# Altium schematic sheet Sheet_1_2021-05-04.schdoc
size 183 x 188 mm
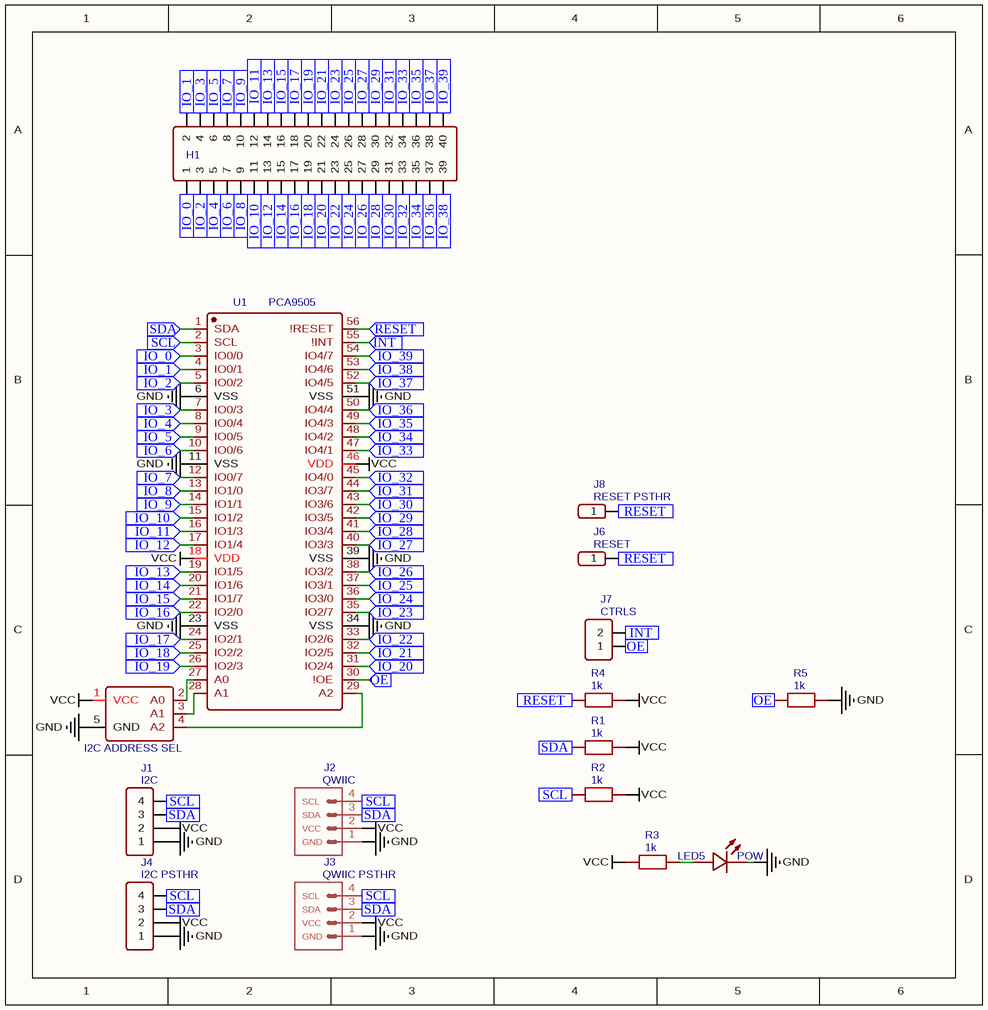
[diagram p0: Sheet_1_2021-05-04.schdoc]

## Parts
H1  HDR-F-2.54_2x20  [HDR-F-2.54_2X20]  (value not drawn)
J1  I2C  [HDR-M-2.54_1X4]
J2  QWIIC  [1X04_1MM_RA]
J3  QWIIC PSTHR  [1X04_1MM_RA]
J4  I2C PSTHR  [HDR-M-2.54_1X4]
J6  RESET  [HDR-M-2.54_1X1]
J7  CTRLS  [HDR-M-2.54_1X2]
J8  RESET PSTHR  [HDR-M-2.54_1X1]
LED5  POW  [LED1206-R-RD]
R1  1k  [R1206]
R2  1k  [R1206]
R3  1k  [R1206]
R4  1k  [R1206]
R5  1k  [R1206]
U1  PCA9505  [PCA9505/06]
U2  I2C ADDRESS SEL  [I2C_ADD_SELECT_PCB]

## Ports
INT (in), IO_0 (in), IO_1 (in), IO_2 (in), IO_3 (in), IO_4 (in), IO_5 (in), IO_6 (in), IO_7 (in), IO_8 (in), IO_9 (in), IO_10 (in), IO_11 (in), IO_12 (in), IO_13 (in), IO_14 (in), IO_15 (in), IO_16 (in), IO_17 (in), IO_18 (in), IO_19 (in), IO_20 (in), IO_21 (in), IO_22 (in), IO_23 (in), IO_24 (in), IO_25 (in), IO_26 (in), IO_27 (in), IO_28 (in), IO_29 (in), IO_30 (in), IO_31 (in), IO_32 (in), IO_33 (in), IO_34 (in), IO_35 (in), IO_36 (in), IO_37 (in), IO_38 (in), IO_39 (in), OE (in), RESET (in), SCL (in), SDA (in)

## Nets
GND: J1.1 J2.1 J3.1 J4.1 LED5.2(K) R5.2 U1.6(VSS) U1.11(VSS) U1.23(VSS) U1.34(VSS) U1.39(VSS) U1.51(VSS) U2.5(GND)
VCC: J1.2 J2.2 J3.2 J4.2 R1.2 R2.2 R3.1 R4.2 U1.18(VDD) U1.46(VDD) U2.1(VCC)
INT: J7.2 U1.55(!INT) ; port INT
IO_0: H1.1 U1.3(IO0/0) ; port IO_0
IO_1: H1.2 U1.4(IO0/1) ; port IO_1
IO_2: H1.3 U1.5(IO0/2) ; port IO_2
IO_3: H1.4 U1.7(IO0/3) ; port IO_3
IO_4: H1.5 U1.8(IO0/4) ; port IO_4
IO_5: H1.6 U1.9(IO0/5) ; port IO_5
IO_6: H1.7 U1.10(IO0/6) ; port IO_6
IO_7: H1.8 U1.12(IO0/7) ; port IO_7
IO_8: H1.9 U1.13(IO1/0) ; port IO_8
IO_9: H1.10 U1.14(IO1/1) ; port IO_9
IO_10: H1.11 U1.15(IO1/2) ; port IO_10
IO_11: H1.12 U1.16(IO1/3) ; port IO_11
IO_12: H1.13 U1.17(IO1/4) ; port IO_12
IO_13: H1.14 U1.19(IO1/5) ; port IO_13
IO_14: H1.15 U1.20(IO1/6) ; port IO_14
IO_15: H1.16 U1.21(IO1/7) ; port IO_15
IO_16: H1.17 U1.22(IO2/0) ; port IO_16
IO_17: H1.18 U1.24(IO2/1) ; port IO_17
IO_18: H1.19 U1.25(IO2/2) ; port IO_18
IO_19: H1.20 U1.26(IO2/3) ; port IO_19
IO_20: H1.21 U1.31(IO2/4) ; port IO_20
IO_21: H1.22 U1.32(IO2/5) ; port IO_21
IO_22: H1.23 U1.33(IO2/6) ; port IO_22
IO_23: H1.24 U1.35(IO2/7) ; port IO_23
IO_24: H1.25 U1.36(IO3/0) ; port IO_24
IO_25: H1.26 U1.37(IO3/1) ; port IO_25
IO_26: H1.27 U1.38(IO3/2) ; port IO_26
IO_27: H1.28 U1.40(IO3/3) ; port IO_27
IO_28: H1.29 U1.41(IO3/4) ; port IO_28
IO_29: H1.30 U1.42(IO3/5) ; port IO_29
IO_30: H1.31 U1.43(IO3/6) ; port IO_30
IO_31: H1.32 U1.44(IO3/7) ; port IO_31
IO_32: H1.33 U1.45(IO4/0) ; port IO_32
IO_33: H1.34 U1.47(IO4/1) ; port IO_33
IO_34: H1.35 U1.48(IO4/2) ; port IO_34
IO_35: H1.36 U1.49(IO4/3) ; port IO_35
IO_36: H1.37 U1.50(IO4/4) ; port IO_36
IO_37: H1.38 U1.52(IO4/5) ; port IO_37
IO_38: H1.39 U1.53(IO4/6) ; port IO_38
IO_39: H1.40 U1.54(IO4/7) ; port IO_39
OE: J7.1 R5.1 U1.30(!OE) ; port OE
RESET: J6.1 J8.1 R4.1 U1.56(!RESET) ; port RESET
SCL: J1.4 J2.4 J3.4 J4.4 R2.1 U1.2(SCL) ; port SCL
SDA: J1.3 J2.3 J3.3 J4.3 R1.1 U1.1(SDA) ; port SDA
NetLED5_1: LED5.1(A) R3.2
NetU1_27: U1.27(A0) U2.2(A0)
NetU1_28: U1.28(A1) U2.3(A1)
NetU1_29: U1.29(A2) U2.4(A2)

## Notes on the sheet
- (in symbol QWIIC) SCL; SDA; VCC; GND
- (in symbol QWIIC PSTHR) SCL; SDA; VCC; GND

## Library data of the parts
H1 = HDR-F-2.54_2x20: Contributor: LCEDA_Lib; BOM_Supplier Part: C50982; BOM_Supplier: LCSC; spicePre: H; spiceSymbolName: HDR-F-2.54_2x20
J1 = I2C: Contributor: LCEDA_Lib; BOM_Supplier Part: C124378; BOM_Supplier: LCSC; spicePre: J; spiceSymbolName: HDR-M-2.54_1x4
J2 = QWIIC: BOM_Manufacturer: Sparkfun; BOM_Manufacturer Part Number: PRT-14417; Contributor: elvedin.rosic; spicePre: J; spiceSymbolName: QWIIC_CONNECTOR_JS-1MM
J3 = QWIIC PSTHR: BOM_Manufacturer: Sparkfun; BOM_Manufacturer Part Number: PRT-14417; Contributor: elvedin.rosic; spicePre: J; spiceSymbolName: QWIIC_CONNECTOR_JS-1MM
J4 = I2C PSTHR: Contributor: LCEDA_Lib; BOM_Supplier Part: C124378; BOM_Supplier: LCSC; spicePre: J; spiceSymbolName: HDR-M-2.54_1x4
J6 = RESET: Contributor: LCEDA_Lib; BOM_Supplier Part: C81276; BOM_Supplier: LCSC; spicePre: J; spiceSymbolName: HDR-M-2.54_1x1
J7 = CTRLS: Contributor: LCEDA_Lib; BOM_Supplier Part: C124375; BOM_Supplier: LCSC; spicePre: J; spiceSymbolName: HDR-M-2.54_1x2
J8 = RESET PSTHR: Contributor: LCEDA_Lib; BOM_Supplier Part: C81276; BOM_Supplier: LCSC; spicePre: J; spiceSymbolName: HDR-M-2.54_1x1
LED5 = POW: SMT Type: Extend; Contributor: M2k Pcb; image: //image.lceda.cn/szlcsc/C49018.jpg; BOM_Supplier Part: L001; BOM_LCSC Assembly: Yes; spicePre: L; spiceSymbolName: 1206 Red LED
R1-R5 = 1k: nameAlias: Value(Ω); Contributor: LCEDA_Lib; spicePre: R; spiceSymbolName: R_1206_EU
U2 = I2C ADDRESS SEL: Contributor: bipbip59; spicePre: U; spiceSymbolName: I2C ADDRESS SEL
U1 = PCA9505: spicePre: X; spiceSymbolName: PCA9505